# Altium schematic sheet MCU_Power.SchDoc
size 420 x 297 mm
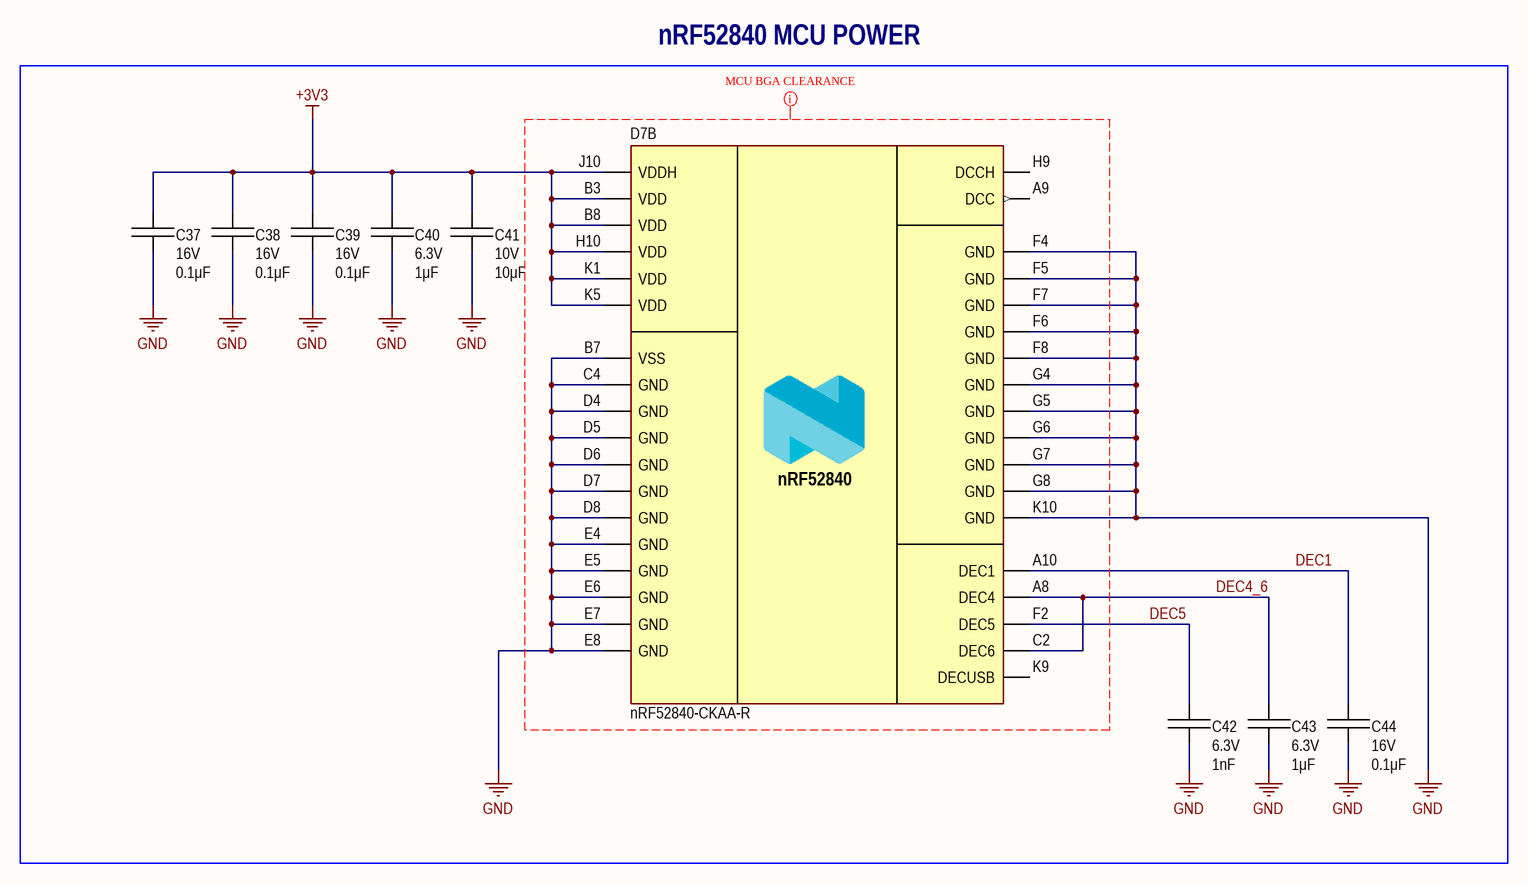
[diagram p0: MCU_Power.SchDoc]

## Parts
C37  value 0.1μF  Voltage: 16V  [CAP: 0402_NO_SILK]
C38  value 0.1μF  Voltage: 16V  [CAP: 0402_NO_SILK]
C39  value 0.1μF  Voltage: 16V  [CAP: 0402_NO_SILK]
C40  value 1μF  Voltage: 6.3V  [CAP: 0402_NO_SILK]
C41  value 10μF  Voltage: 10V  [CAP: 0805]
C42  value 1nF  Voltage: 6.3V  [CAP: 0402_NO_SILK]
C43  value 1μF  Voltage: 6.3V  [CAP: 0402_NO_SILK]
C44  value 0.1μF  Voltage: 16V  [CAP: 0402_NO_SILK]
D7  PartNumber: nRF52840-CKAA-R  [MCU: nRF52840_WLCP93]  (part B of 2)

## Blocks framed on the sheet
nRF52840 MCU POWER: C37-C44 D7

## Nets
+3V3: C37.2 C38.2 C39.2 C40.2 C41.2 D7.B3(VDD) D7.B8(VDD) D7.H10(VDD) D7.J10(VDDH) D7.K1(VDD) D7.K5(VDD)
GND: C37.1 C38.1 C39.1 C40.1 C41.1 C42.1 C43.1 C44.1 D7.B7(VSS) D7.C4(GND) D7.D4(GND) D7.D5(GND) D7.D6(GND) D7.D7(GND) D7.D8(GND) D7.E4(GND) D7.E5(GND) D7.E6(GND) D7.E7(GND) D7.E8(GND) D7.F4(GND) D7.F5(GND) D7.F6(GND) D7.F7(GND) D7.F8(GND) D7.G4(GND) D7.G5(GND) D7.G6(GND) D7.G7(GND) D7.G8(GND) D7.K10(GND)
DEC1: C44.2 D7.A10(DEC1)
DEC4_6: C43.2 D7.A8(DEC4) D7.C2(DEC6)
DEC5: C42.2 D7.F2(DEC5)

Not connected (* = marked no-connect by the designer): D7 A9(DCC) H9(DCCH) K9(DECUSB)

## Layout directives
net class MCU_BGA_CLEARANCE: (no net found under the mark)

## Notes on the sheet
- Author
- Manufacturer
- Date
- Page
- Total pages
- Size page
- A3
- Materials

## Library data of the parts
C37-C39 C44 = Ceramic_0402: 0.1 µF ±10% 16V Ceramic Capacitor X7R 0402 (1005 Metric); Manufacturer: Yageo; PartNumber: CC0402KRX7R7BB104; ValueManufacturerPartNumber: Ceramic capacitor, 0.1μF, X7R, ±10%, 16V, 0402, -55...+125°C; Package: 0402; HelpURL: https://www.digikey.com/product-detail/en/yageo/CC0402KRX7R7BB104/311-1338-1-ND/2103122; Temperature: -55...+125°C; TypeCapacitor: Ceramic capacitor; Tolerance: ±10%; TypeDielectric: X7R
C40 C43 = Ceramic_0402: 0.1 µF ±10% 16V Ceramic Capacitor X7R 0402 (1005 Metric); Manufacturer: Yageo; PartNumber: CC0402KRX7R5BB105; ValueManufacturerPartNumber: Ceramic capacitor, 1μF, X7R, ±10%, 6.3V, 0402, -55...+125°C; Package: 0402; HelpURL: https://www.digikey.com/en/products/detail/yageo/CC0402KRX7R5BB105/5195111; Temperature: -55...+125°C; TypeCapacitor: Ceramic capacitor; Tolerance: ±10%; TypeDielectric: X7R
C41 = Ceramic_0805: 10 µF ±10% 10V Ceramic Capacitor X7R 0805 (2012 Metric); Manufacturer: Yageo; PartNumber: CC0805KFX7R6BB106; ValueManufacturerPartNumber: Ceramic capacitor, 10μF, X7R, ±10%, 10V, 0805, -55...+125°C; Package: 0805; HelpURL: https://www.digikey.com/en/products/detail/yageo/CC0805KFX7R6BB106/11611326; Temperature: -55...+125°C; TypeCapacitor: Ceramic capacitor; Tolerance: ±10%; TypeDielectric: X7R
C42 = Ceramic_0402: 1000 pF ±5% 25V Ceramic Capacitor C0G, NP0 0402 (1005 Metric); Manufacturer: Yageo; PartNumber: CC0402JRNPO8BN102; ValueManufacturerPartNumber: Ceramic capacitor, 1nF, X7R, ±10%, 6.3V, 0402, -55...+125°C; Tolerance: ±10%; TypeDielectric: X7R; Package: 0402; HelpURL: https://www.digikey.com/en/products/detail/yageo/CC0402JRNPO8BN102/5195068; Temperature: -55...+125°C; TypeCapacitor: Ceramic capacitor
D7 = nRF52840: MCU; Manufacturer: Nordic Semiconductor; CoreSize: 32bit; Speed: 64 MHz; MemoryROM: 1 MB; CoreProcessor: Cortex-M4; MemoryRAM: 256 kB; HelpURL: https://www.mouser.com/ProductDetail/Nordic-Semiconductor/nRF52840-CKAA-R?qs=PqoDHHvF64%2FDLCQsJ11t5w%3D%3D; ComponentType: IC microcontroller; Package: 93-WLCSP; ValueManufacturerPartNumber: =ComponentType+', '+CoreSize+', '+CoreProcessor+', '+Speed+', '+MemoryROM+', '+MemoryRAM+', '+Supply+', '+Temperature+', '+Package